# Altium schematic sheet Sheet1.SchDoc
size A
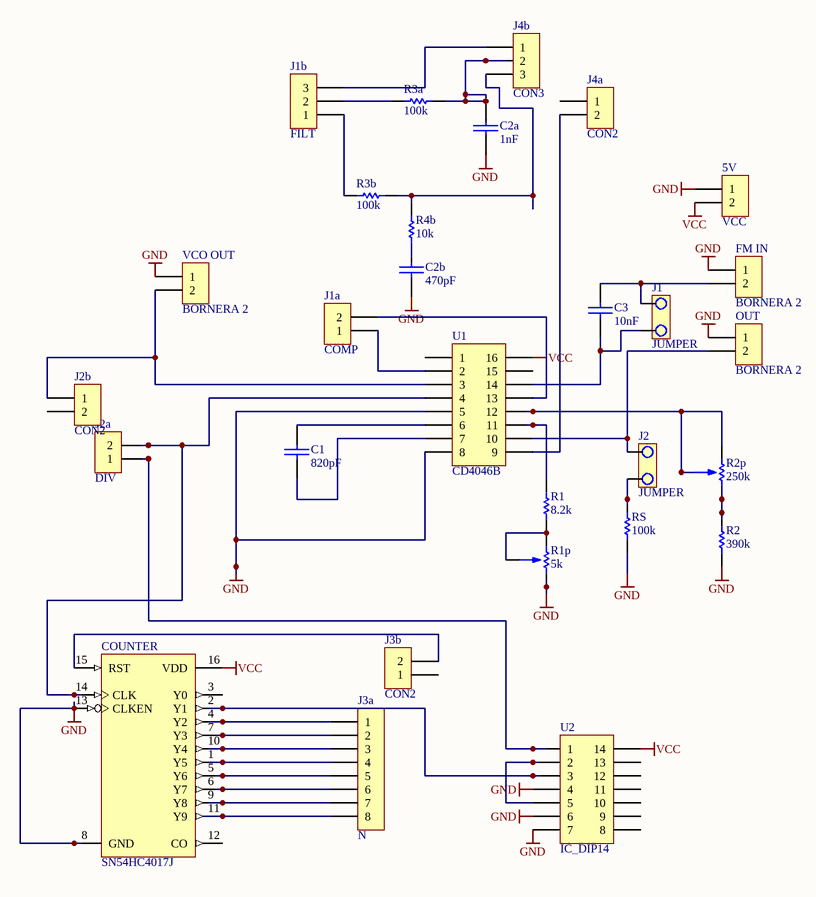
[diagram p0: Sheet1.SchDoc]

## Parts
5V  VCC  [BORNERA2]
C1  820pF  [CAP200]
C2a  1nF  [CAP200]
C2b  470pF  [CAP200]
C3  10nF  [CAP200]
COUNTER  SN54HC4017J  [J016]
FM_IN  BORNERA 2  [BORNERA2]
J1  JUMPER  [JUMPER2]
J1a  COMP  [SIP2]
J1b  FILT  [SIP3]
J2  JUMPER  [JUMPER2]
J2a  DIV  [SIP2]
J2b  CON2  [SIP2]
J3a  N  [SIP8]
J3b  CON2  [SIP2]
J4a  CON2  [SIP2]
J4b  CON3  [SIP3]
OUT  BORNERA 2  [BORNERA2]
R1  8.2k  [RES300]
R1p  5k  [PRESET V]
R2  390k  [RES300]
R2p  250k  [PRESET V]
R3a  100k  [RES300]
R3b  100k  [RES300]
R4b  10k  [RES300]
RS  100k  [RES300]
U1  CD4046B  [DIP16]
U2  IC_DIP14  [DIP14]
VCO_OUT  BORNERA 2  [BORNERA2]

## Nets
GND: 5V.1 C2a.2 C2b.2 COUNTER.8(GND) COUNTER.13(CLKEN) FM_IN.1 OUT.1 R1p.1 R2.1 RS.1 U1.5 U1.8 U2.4 U2.6 U2.7 VCO_OUT.1
VCC: 5V.2 COUNTER.16(VDD) U1.16 U2.14
NetC1_1: C1.1 U1.6
NetC1_2: C1.2 U1.7
NetC2a_1: C2a.1 J4b.2 R3a.2
NetC2b_1: C2b.1 R4b.1
NetC3_1: C3.1 FM_IN.2 J1.2
NetC3_2: C3.2 J1.1 U1.14
NetCOUNTER_1: COUNTER.1(Y5) J3a.4
NetCOUNTER_2: COUNTER.2(Y1) U2.3
NetCOUNTER_4: COUNTER.4(Y2) J3a.1
NetCOUNTER_5: COUNTER.5(Y6) J3a.5
NetCOUNTER_6: COUNTER.6(Y7) J3a.6
NetCOUNTER_7: COUNTER.7(Y3) J3a.2
NetCOUNTER_9: COUNTER.9(Y8) J3a.7
NetCOUNTER_10: COUNTER.10(Y4) J3a.3
NetCOUNTER_11: COUNTER.11(Y9) J3a.8
NetCOUNTER_14: COUNTER.14(CLK) J2a.2 U1.4
NetCOUNTER_15: COUNTER.15(RST) J3b.2
NetJ1a_1: J1a.1 U1.2
NetJ1a_2: J1a.2 U1.13
NetJ1b_1: J1b.1 R3b.1
NetJ1b_2: J1b.2 R3a.1
NetJ1b_3: J1b.3 J4b.1
NetJ2_1: J2.1 RS.2
NetJ2_2: J2.2 OUT.2 U1.10
NetJ2a_1: J2a.1 U2.1
NetJ2b_1: J2b.1 U1.3 VCO_OUT.2
NetJ4a_2: J4a.2 U1.9
NetJ4b_3: J4b.3 R3b.2 R4b.2
NetR1_1: R1.1 R1p.2 R1p.3
NetR1_2: R1.2 U1.11
NetR2_2: R2.2 R2p.1
NetR2p_2: R2p.2 R2p.3 U1.12
NetU2_2: U2.2 U2.5

Not connected (* = marked no-connect by the designer): COUNTER 3(Y0) 12(CO); J2b 2; J3b 1; J4a 1; U1 1 15; U2 8 9 10 11 12 13

## Library data of the parts
5V = BORNERA 2
C1 C2a C2b C3 = CAP
COUNTER = SN54HC4017J: Decade Counter / Divider; Published: 8-Jun-2000; LatestRevisionDate: 04-Mar-2005; LatestRevisionNote: Stylized 3D Model Added.; DatasheetVersion: Jun-1989; PackageVersion: Jun-1999; PackageReference: J016; Publisher: Altium Limited; PackageDescription: DIP; 16 Leads; Row Spacing 7.62 mm; Pitch 2.54 mm; ComponentLink1Description: Manufacturer Link; ComponentLink1URL: http://www.ti.com/; ComponentLink2Description: Datasheet; ComponentLink2URL: http://www-s.ti.com/sc/ds/sn74hc4017.pdf
J1a J2a = CON2
J1b = CON3
J3a = CON8
R1 R2 R3a R3b R4b RS = RES
R1p R2p = PRESET
U1 = IC_DIP16